# Altium schematic sheet Snippet_TPIC6B595D.SchDoc
size 1188 x 840 mm
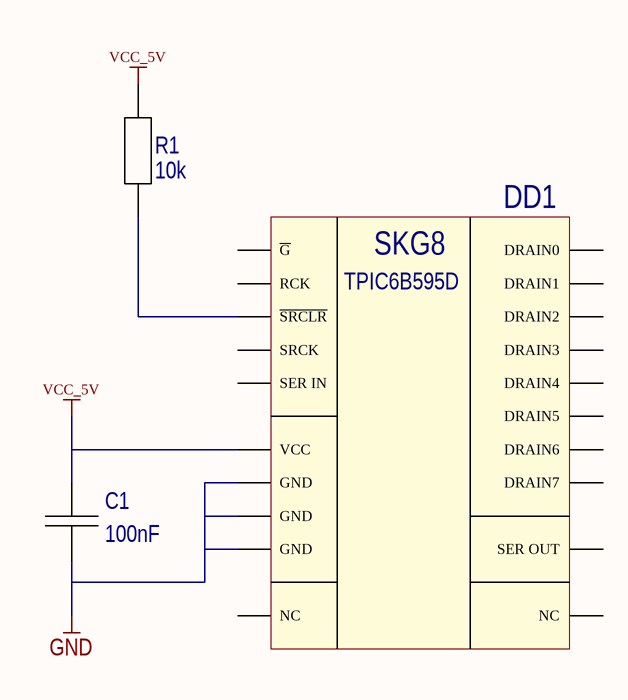
[diagram p0: Snippet_TPIC6B595D.SchDoc]

## Parts
C1  100nF  [Capacitor_0805]
DD1  TPIC6B595D  [SOIC-20]  (value not drawn)
R1  10k  [RESISTOR_SMD0805]

## Nets
GND: C1.1 DD1.10(GND) DD1.11(GND) DD1.19(GND)
VCC_5V: C1.2 DD1.2(VCC) R1.2
NetDD1_8: DD1.8(~{SRCLR}) R1.1

Not connected (* = marked no-connect by the designer): DD1 1(NC) 3(SER_IN) 4(DRAIN0) 5(DRAIN1) 6(DRAIN2) 7(DRAIN3) 9(~{G}) 12(RCK) 13(SRCK) 14(DRAIN4) 15(DRAIN5) 16(DRAIN6) 17(DRAIN7) 18(SER_OUT) 20(NC)

## Notes on the sheet
- (in symbol TPIC6B595D) SKG8

## Library data of the parts
C1 = Capacitor_0805
R1 = Resistor_0805